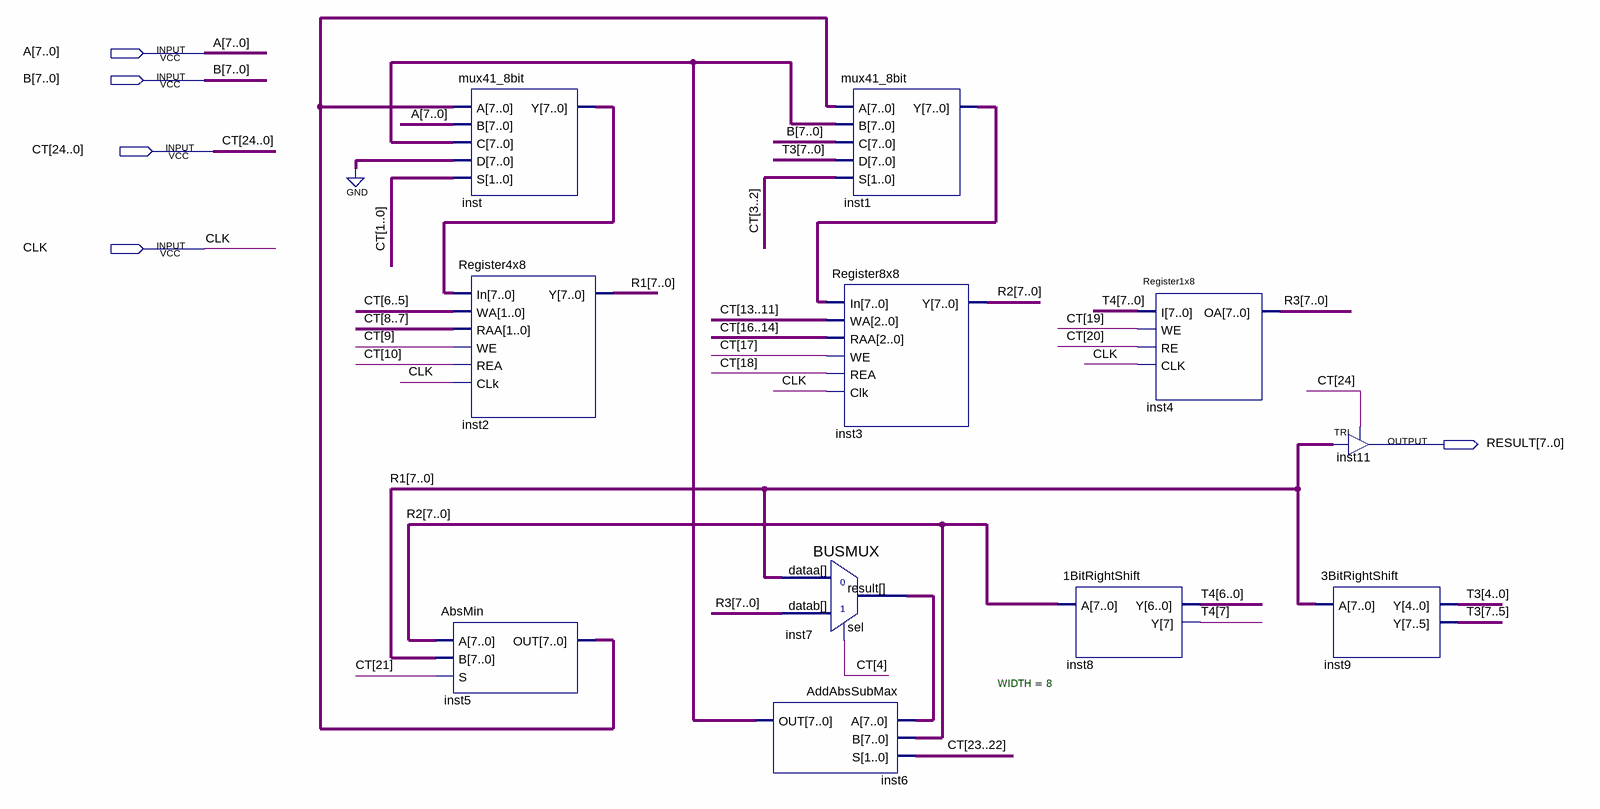
[diagram p0: schematic sheet]
// Quartus schematic DATAPATH_DC.bdf as structural Verilog: 11 symbols, 5 pins
module DATAPATH_DC (
  input  [7:0] A,
  input  [7:0] B,
  input  [24:0] CT,
  input  CLK,
  output [7:0] RESULT
);

  wire [7:0] inst1_y, inst5_out, inst6_out, inst7_result, inst_y, R1, R2, R3, T3, T4;

  mux41_8bit inst (.A(inst5_out), .B(A), .C(inst6_out), .D({8{1'b0}}), .S(CT[1:0]), .Y(inst_y));
  Register4x8 inst2 (.In(inst_y), .WA(CT[6:5]), .RAA(CT[8:7]), .WE(CT[9]), .REA(CT[10]), .CLk(CLK), .Y(R1));
  AbsMin inst5 (.A(R2), .B(R1), .S(CT[21]), .OUT(inst5_out));
  AddAbsSubMax inst6 (.A(inst7_result), .B(R2), .S(CT[23:22]), .OUT(inst6_out));
  mux41_8bit inst1 (.A(inst5_out), .B(inst6_out), .C(B), .D(T3), .S(CT[3:2]), .Y(inst1_y));
  Register8x8 inst3 (.In(inst1_y), .WA(CT[13:11]), .RAA(CT[16:14]), .WE(CT[17]), .REA(CT[18]), .Clk(CLK), .Y(R2));
  BUSMUX #(.WIDTH(8)) inst7 (.datab(R3), .sel(CT[4]), .dataa(R1), .result(inst7_result));
  \1BitRightShift  inst8 (.A(R2), .Y(T4));
  Register1x8 inst4 (.I(T4), .WE(CT[19]), .RE(CT[20]), .CLK(CLK), .OA(R3));
  TRI inst11[7:0] (.IN(R1), .OE(CT[24]), .OUT(RESULT));
  \3BitRightShift  inst9 (.A(R1), .Y(T3));
endmodule
